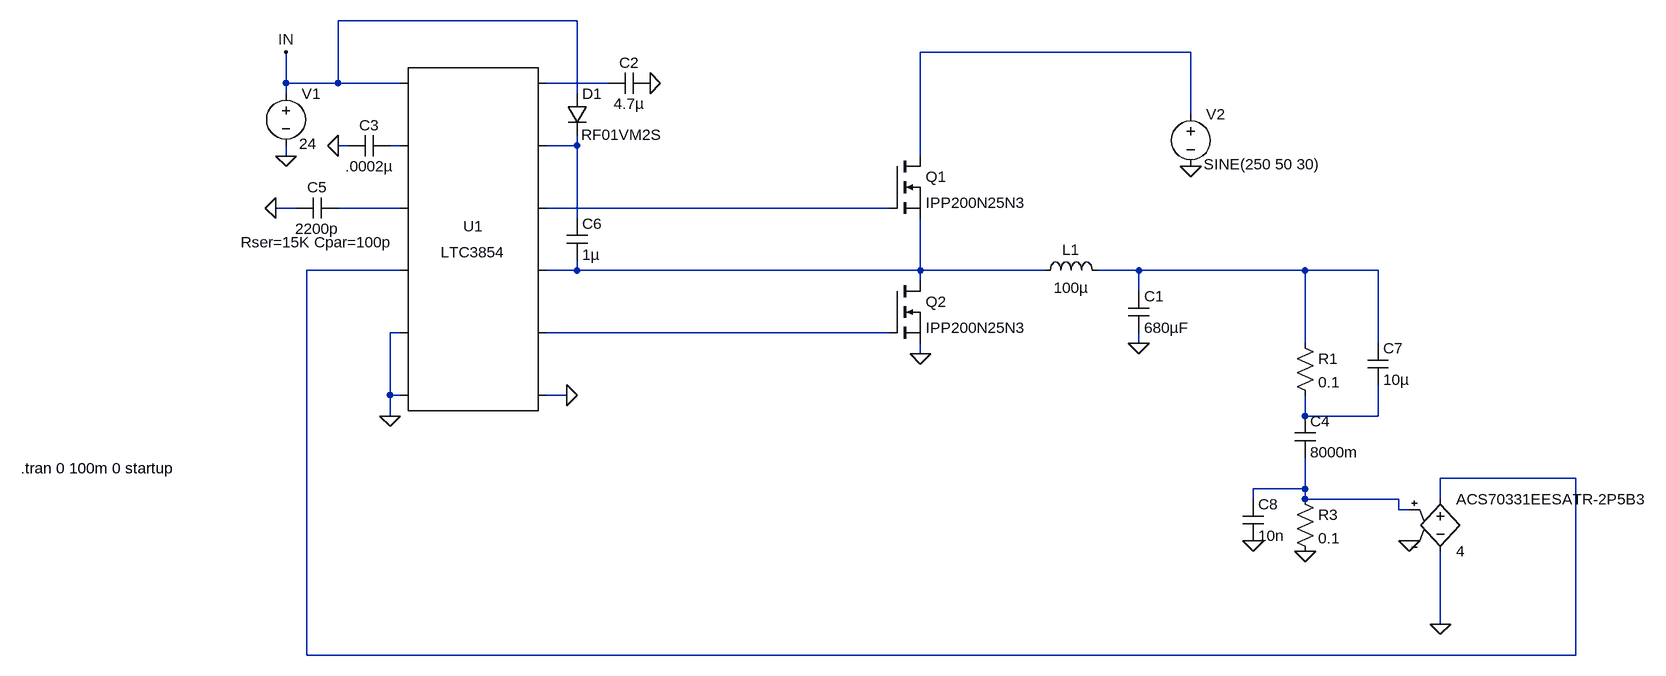
[diagram p0: schematic 3854.asc]
3854.asc, the LTspice schematic file:
Version 4
SHEET 1 2364 928
WIRE 336 -112 -32 -112
WIRE 1280 -64 864 -64
WIRE -112 -16 -112 -64
WIRE -32 -16 -32 -112
WIRE -32 -16 -112 -16
WIRE 64 -16 -32 -16
WIRE 384 -16 288 -16
WIRE -112 0 -112 -16
WIRE 336 0 336 -112
WIRE 1280 32 1280 -64
WIRE -16 80 -32 80
WIRE 64 80 48 80
WIRE 336 80 336 64
WIRE 336 80 288 80
WIRE -112 96 -112 80
WIRE 864 96 864 -64
WIRE -96 176 -128 176
WIRE 64 176 -32 176
WIRE 816 176 288 176
WIRE 336 192 336 80
WIRE 64 272 -80 272
WIRE 336 272 336 256
WIRE 336 272 288 272
WIRE 864 272 864 192
WIRE 864 272 336 272
WIRE 1056 272 864 272
WIRE 1200 272 1136 272
WIRE 1456 272 1200 272
WIRE 1568 272 1456 272
WIRE 864 288 864 272
WIRE 1200 304 1200 272
WIRE 64 368 48 368
WIRE 816 368 288 368
WIRE 1200 384 1200 368
WIRE 1456 384 1456 272
WIRE 1568 384 1568 272
WIRE 864 400 864 384
WIRE 48 464 48 368
WIRE 64 464 48 464
WIRE 320 464 288 464
WIRE 48 496 48 464
WIRE 1456 496 1456 464
WIRE 1568 496 1568 448
WIRE 1568 496 1456 496
WIRE 1872 592 1664 592
WIRE 1456 608 1456 560
WIRE 1456 608 1376 608
WIRE 1376 624 1376 608
WIRE 1456 624 1456 608
WIRE 1600 624 1456 624
WIRE 1664 624 1664 592
WIRE 1600 640 1600 624
WIRE 1616 640 1600 640
WIRE 1664 816 1664 704
WIRE -80 864 -80 272
WIRE 1872 864 1872 592
WIRE 1872 864 -80 864
FLAG 320 464 0
FLAG 864 400 0
FLAG 1200 384 0
FLAG -32 80 0
FLAG -112 96 0
FLAG -112 -64 IN
FLAG -128 176 0
FLAG 1280 112 0
FLAG 48 496 0
FLAG 1456 704 0
FLAG 1616 688 0
FLAG 1664 816 0
FLAG 448 -16 0
FLAG 1376 688 0
SYMBOL nmos 816 96 R0
SYMATTR InstName Q1
SYMATTR Value IPP200N25N3
SYMBOL ind 1040 288 R270
WINDOW 0 32 56 VTop 2
WINDOW 3 5 56 VBottom 2
SYMATTR InstName L1
SYMATTR Value 100µ
SYMATTR SpiceLine Rser=140m
SYMBOL cap 1184 304 R0
SYMATTR SpiceLine Rser=4.5m
SYMATTR InstName C1
SYMATTR Value 680µF
SYMBOL cap 384 0 R270
WINDOW 0 32 32 VTop 2
WINDOW 3 0 32 VBottom 2
SYMATTR InstName C2
SYMATTR Value 4.7µ
SYMBOL cap 48 64 R90
WINDOW 0 0 32 VBottom 2
WINDOW 3 32 32 VTop 2
SYMATTR InstName C3
SYMATTR Value .0002µ
SYMBOL voltage -112 -16 R0
WINDOW 3 20 93 Left 2
WINDOW 123 0 0 Left 2
WINDOW 39 0 0 Left 2
SYMATTR Value 24
SYMATTR InstName V1
SYMBOL diode 320 0 R0
WINDOW 3 22 63 Left 2
SYMATTR Value RF01VM2S
SYMATTR InstName D1
SYMBOL nmos 816 288 R0
SYMATTR InstName Q2
SYMATTR Value IPP200N25N3
SYMBOL cap -32 160 R90
WINDOW 0 0 32 VBottom 2
WINDOW 3 32 32 VTop 2
WINDOW 39 53 32 VTop 2
SYMATTR InstName C5
SYMATTR Value 2200p
SYMATTR SpiceLine Rser=15K Cpar=100p
SYMBOL PowerProducts\\LTC3854 176 224 R0
SYMATTR InstName U1
SYMBOL cap 320 192 R0
SYMATTR InstName C6
SYMATTR Value 1µ
SYMBOL voltage 1280 16 R0
WINDOW 3 20 93 Left 2
WINDOW 123 0 0 Left 2
WINDOW 39 0 0 Left 2
SYMATTR Value SINE(250 50 30)
SYMATTR InstName V2
SYMBOL e 1664 608 R0
SYMATTR InstName ACS70331EESATR-2P5B3
SYMATTR Value 4
SYMBOL res 1440 608 R0
SYMATTR InstName R3
SYMATTR Value 0.1
SYMBOL res 1440 368 R0
SYMATTR InstName R1
SYMATTR Value 0.1
SYMBOL cap 1440 496 R0
SYMATTR InstName C4
SYMATTR Value 8000m
SYMATTR Value2 IC=24
SYMBOL cap 1360 624 R0
SYMATTR InstName C8
SYMATTR Value 10n
SYMBOL cap 1552 384 R0
SYMATTR InstName C7
SYMATTR Value 10µ
TEXT -520 576 Left 2 !.tran 0 100m 0 startup

The netlist it stands for:
* 3854.asc
M§Q1 N001 N006 N008 N008 IPP200N25N3
L1 N008 N009 100µ Rser=140m
C1 N009 0 680µF Rser=4.5m
C2 N002 0 4.7µ
C3 N003 0 .0002µ
V1 IN 0 24
D1 IN N004 RF01VM2S
M§Q2 N008 N010 0 0 IPP200N25N3
C5 N005 0 2200p Rser=15K Cpar=100p
XU1 N007 N005 N003 N004 N006 N008 0 N010 N002 IN 0 0 LTC3854
C6 N004 N008 1µ
V2 N001 0 SINE(250 50 30)
E§ACS70331EESATR-2P5B3 N007 0 N012 0 4
R3 N012 0 0.1
R1 N009 N011 0.1
C4 N011 N012 8000m IC=24
C8 N012 0 10n
C7 N009 N011 10µ
.model D D
.lib standard.dio
.model NMOS NMOS
.model PMOS PMOS
.lib standard.mos
.tran 0 100m 0 startup
.lib LTC3854.sub
.backanno
.end